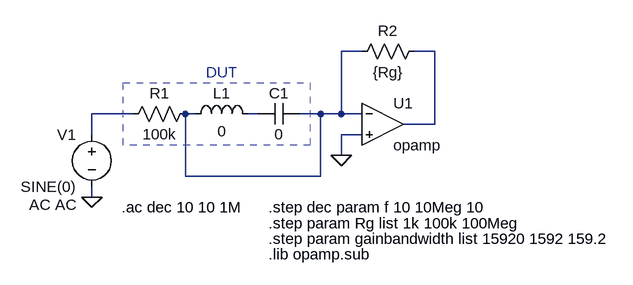
[diagram p0: schematic Draft1.asc]
Draft1.asc, the LTspice schematic file:
Version 4
SHEET 1 880 680
WIRE 192 32 160 32
WIRE 304 32 272 32
WIRE -160 128 -224 128
WIRE -64 128 -80 128
WIRE 32 128 16 128
WIRE 128 128 96 128
WIRE 160 128 160 32
WIRE 160 128 128 128
WIRE 192 128 160 128
WIRE 304 144 304 32
WIRE 304 144 256 144
WIRE -224 160 -224 128
WIRE 192 160 160 160
WIRE 160 192 160 160
WIRE -80 224 -80 128
WIRE 128 224 128 128
WIRE 128 224 -80 224
WIRE -224 256 -224 240
FLAG 160 192 0
FLAG -224 256 0
SYMBOL OpAmps\\opamp 224 80 R0
SYMATTR InstName U1
SYMATTR SpiceLine2 GBW={gainbandwidth}
SYMBOL voltage -224 144 M0
WINDOW 123 24 124 Left 2
WINDOW 39 0 0 Left 0
SYMATTR InstName V1
SYMATTR Value SINE(0)
SYMATTR Value2 AC AC
SYMBOL res -64 112 R90
WINDOW 0 0 56 VBottom 2
WINDOW 3 32 56 VTop 2
SYMATTR InstName R1
SYMATTR Value 100k
SYMBOL ind -80 144 R270
WINDOW 0 32 56 VTop 2
WINDOW 3 5 56 VBottom 2
SYMATTR InstName L1
SYMATTR Value 0
SYMBOL cap 96 112 R90
WINDOW 0 0 32 VBottom 2
WINDOW 3 32 32 VTop 2
SYMATTR InstName C1
SYMATTR Value 0
SYMBOL res 288 16 R90
WINDOW 0 0 56 VBottom 2
WINDOW 3 32 56 VTop 2
SYMATTR InstName R2
SYMATTR Value {Rg}
TEXT -48 64 Left 2 ;DUT
TEXT 48 272 Left 2 !.step dec param f 10 10Meg 10
TEXT -178 272 Left 2 !.ac dec 10 10 1M
TEXT 48 296 Left 2 !.step param Rg list 1k 100k 100Meg
TEXT 48 344 Left 2 !.lib opamp.sub
TEXT 48 320 Left 2 !.step param gainbandwidth list 15920 1592 159.2
RECTANGLE Normal 112 176 -176 80 2

The netlist it stands for:
* Draft1.asc
XU1 N001 0 N002 opamp Aol=100K GBW={gainbandwidth}  ; pins invin noninvin out
V1 N003 0 SINE(0) AC AC
R1 N001 N003 100k
L1 N001 N004 0
C1 N001 N004 0
R2 N002 N001 {Rg}
* DUT
.step dec param f 10 10Meg 10
.ac dec 10 10 1M
.step param Rg list 1k 100k 100Meg
.lib opamp.sub
.step param gainbandwidth list 15920 1592 159.2
.backanno
.end